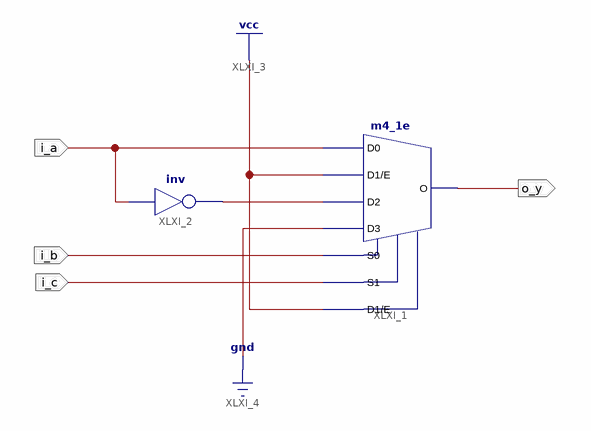
[diagram p0: schematic sheet 1]
// Xilinx ISE schematic Laby6.sch (spartan3e) as structural Verilog: 2 symbols, 4 ports
module Laby6 (
  input  i_a,
  input  i_b,
  input  i_c,
  output o_y
);

  wire XLXN_2;

  m4_1e XLXI_1 (.D0(i_a), .D1(1'b1), .D2(XLXN_2), .D3(1'b0), .E(1'b1), .S0(i_b), .S1(i_c), .O(o_y));
  not XLXI_2 (XLXN_2, i_a);
endmodule
